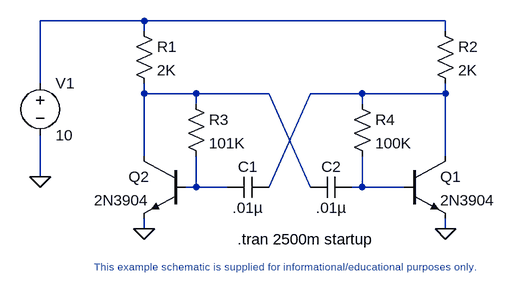
[diagram p0: schematic flicker.asc]
flicker.asc, the LTspice schematic file:
Version 4
SHEET 1 888 1240
WIRE -560 768 -720 768
WIRE -96 768 -560 768
WIRE -560 784 -560 768
WIRE -96 784 -96 768
WIRE -720 864 -720 768
WIRE -560 880 -560 864
WIRE -480 880 -560 880
WIRE -368 880 -480 880
WIRE -224 880 -304 880
WIRE -96 880 -96 864
WIRE -96 880 -224 880
WIRE -480 896 -480 880
WIRE -224 896 -224 880
WIRE -560 976 -560 880
WIRE -96 976 -96 880
WIRE -720 1008 -720 944
WIRE -480 1024 -480 976
WIRE -480 1024 -496 1024
WIRE -432 1024 -480 1024
WIRE -368 1024 -304 880
WIRE -304 1024 -368 880
WIRE -224 1024 -224 976
WIRE -224 1024 -240 1024
WIRE -160 1024 -224 1024
WIRE -560 1088 -560 1072
WIRE -96 1088 -96 1072
FLAG -96 1088 0
FLAG -560 1088 0
FLAG -720 1008 0
SYMBOL RES -576 768 R0
SYMATTR InstName R1
SYMATTR Value 2K
SYMBOL res -112 768 R0
SYMATTR InstName R2
SYMATTR Value 2K
SYMBOL res -496 880 R0
SYMATTR InstName R3
SYMATTR Value 101K
SYMBOL res -240 880 R0
SYMATTR InstName R4
SYMATTR Value 100K
SYMBOL cap -368 1008 R90
WINDOW 0 0 32 VBottom 2
WINDOW 3 32 32 VTop 2
SYMATTR InstName C1
SYMATTR Value .01µ
SYMBOL cap -240 1008 R90
WINDOW 0 0 32 VBottom 2
WINDOW 3 32 32 VTop 2
SYMATTR InstName C2
SYMATTR Value .01µ
SYMBOL VOLTAGE -720 848 R0
SYMATTR InstName V1
SYMATTR Value 10
SYMBOL NPN -160 976 R0
SYMATTR InstName Q1
SYMATTR Value 2N3904
SYMBOL npn -496 976 M0
SYMATTR InstName Q2
SYMATTR Value 2N3904
TEXT -416 1104 Left 2 !.tran 2500m startup
TEXT -352 1136 Top 1 ;This example schematic is supplied for informational/educational purposes only.

The netlist it stands for:
* flicker.asc
R1 N001 N002 2K
R2 N001 N003 2K
R3 N002 N004 101K
R4 N003 N005 100K
C1 N003 N004 .01µ
C2 N005 N002 .01µ
V1 N001 0 10
Q1 N003 N005 0 0 2N3904
Q2 N002 N004 0 0 2N3904
.model NPN NPN
.model PNP PNP
.lib standard.bjt
.tran 2500m startup
* This example schematic is supplied for informational/educational purposes only.
.backanno
.end